# Altium schematic sheet indicators.SchDoc
size A4
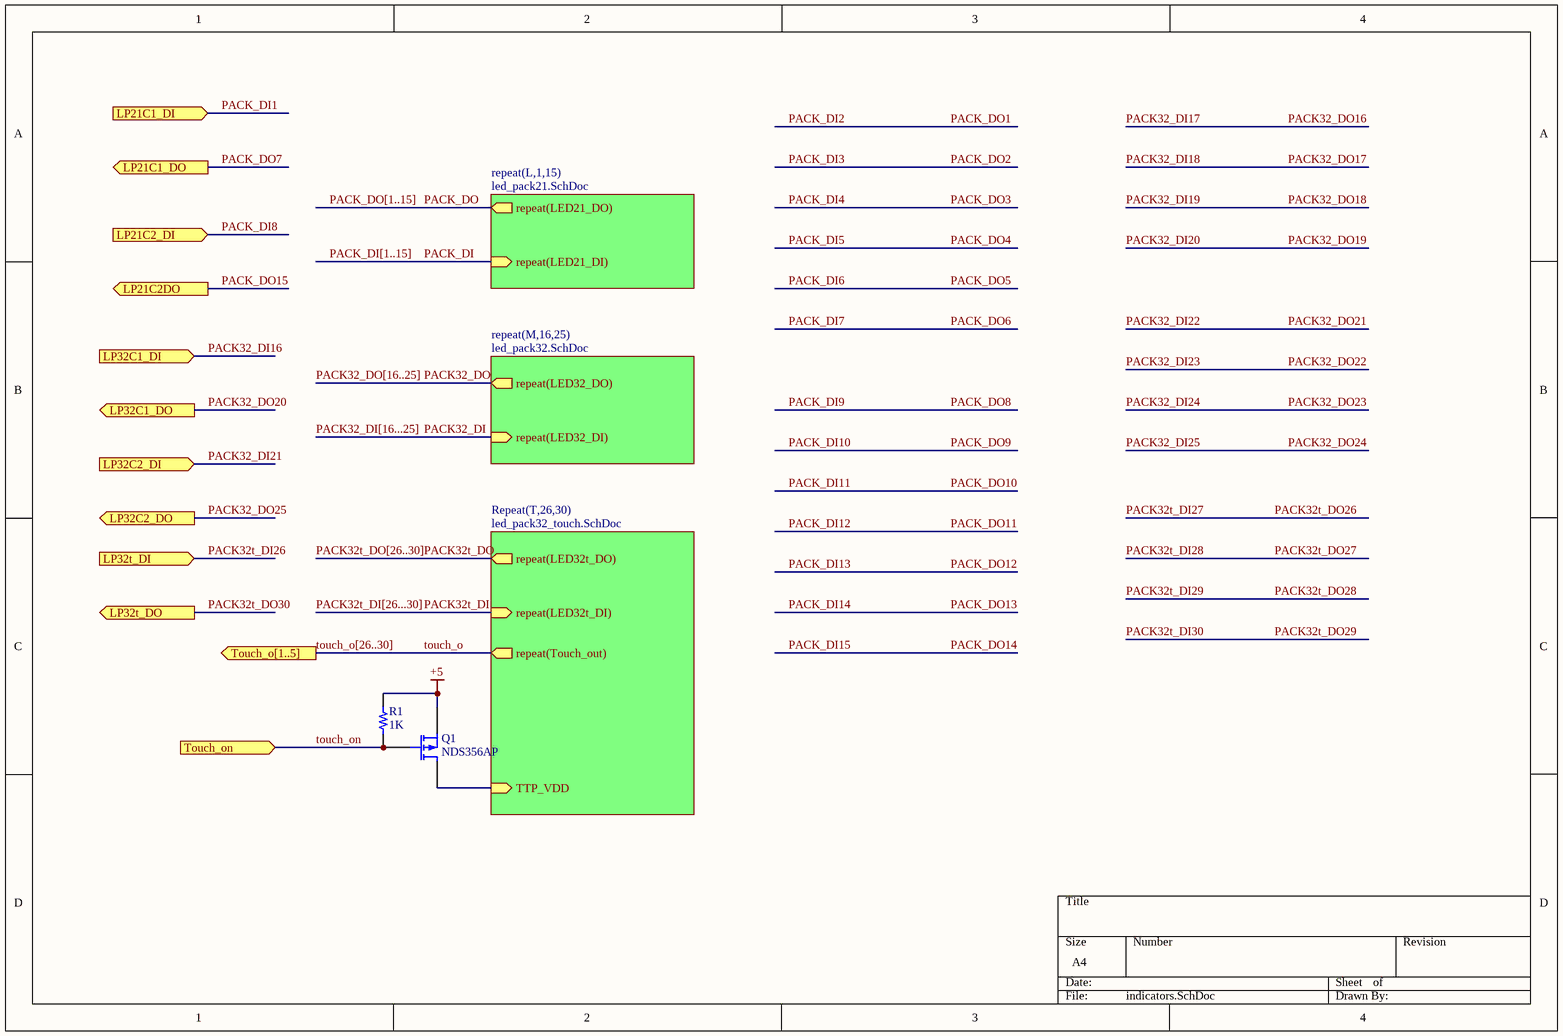
[diagram p0: indicators.SchDoc]

## Parts
Q1  NDS356AP  [soT95p280x130-3n]
R1  1K  [0603R]

## Sub-sheets
repeat(L,1,15) = led_pack21.SchDoc: repeat(LED21_DO) (out), repeat(LED21_DI) (in)
repeat(M,16,25) = led_pack32.SchDoc: repeat(LED32_DO) (out), repeat(LED32_DI) (in)
Repeat(T,26,30) = led_pack32_touch.SchDoc: TTP_VDD (in), repeat(Touch_out) (out), repeat(LED32t_DO) (out), repeat(LED32t_DI) (in)

## Ports
LP21C1_DI (in), LP21C1_DO (out), LP21C2_DI (in), LP21C2DO (out), LP32C1_DI (in), LP32C1_DO (out), LP32C2_DI (in), LP32C2_DO (out), LP32t_DI (in), LP32t_DO (out), Touch_o[1..5] (out), Touch_on (in)

## Nets
+5: Q1.3(S) R1.1
PACK32_DI: sheet repeat(M,16,25)/repeat(LED32_DI)
PACK32_DI16: port LP32C1_DI
PACK32_DI21: port LP32C2_DI
PACK32_DO: sheet repeat(M,16,25)/repeat(LED32_DO)
PACK32_DO20: port LP32C1_DO
PACK32_DO25: port LP32C2_DO
PACK32t_DI: sheet Repeat(T,26,30)/repeat(LED32t_DI)
PACK32t_DI26: port LP32t_DI
PACK32t_DO: sheet Repeat(T,26,30)/repeat(LED32t_DO)
PACK32t_DO30: port LP32t_DO
PACK_DI: sheet repeat(L,1,15)/repeat(LED21_DI)
PACK_DI1: port LP21C1_DI
PACK_DI8: port LP21C2_DI
PACK_DO: sheet repeat(L,1,15)/repeat(LED21_DO)
PACK_DO7: port LP21C1_DO
PACK_DO15: port LP21C2DO
touch_o: sheet Repeat(T,26,30)/repeat(Touch_out)
touch_on: Q1.2(G) R1.2 ; port Touch_on
NetQ1_1: Q1.1(D) ; sheet Repeat(T,26,30)/TTP_VDD

## Buses and harness runs
bus PACK32_DI[16...25]
bus PACK32_DO[16..25]
bus PACK32t_DI[26...30]
bus PACK32t_DO[26..30]
bus PACK_DI[1..15]
bus PACK_DO[1..15]
bus touch_o[26..30] = port Touch_o[1..5]

## Library data of the parts
Q1 = MOSFET-P: P-Channel MOSFET SOT23; pin to pad: 1>3 2>1 3>2; Published: 8-Jun-2000; LatestRevisionDate: 17-Jul-2002; LatestRevisionNote: Re-released for DXP Platform.; PackageVersion: 1995/1996; PackageReference: E3; Publisher: Altium Limited; PackageDescription: TO, Flat Index; 3 In-Line, Axial Leads; Body Dia. 4.6mm; Lead Dia. 0.5 mm (max)
R1 = Resistor: RES SMD 0603; Part Number: RCS0805100KFKEA; Value: 1K